# Altium schematic sheet 1_RPi.SchDoc
size A4; DocumentNumber: 1; SheetNumber: 1; SheetTotal: 5
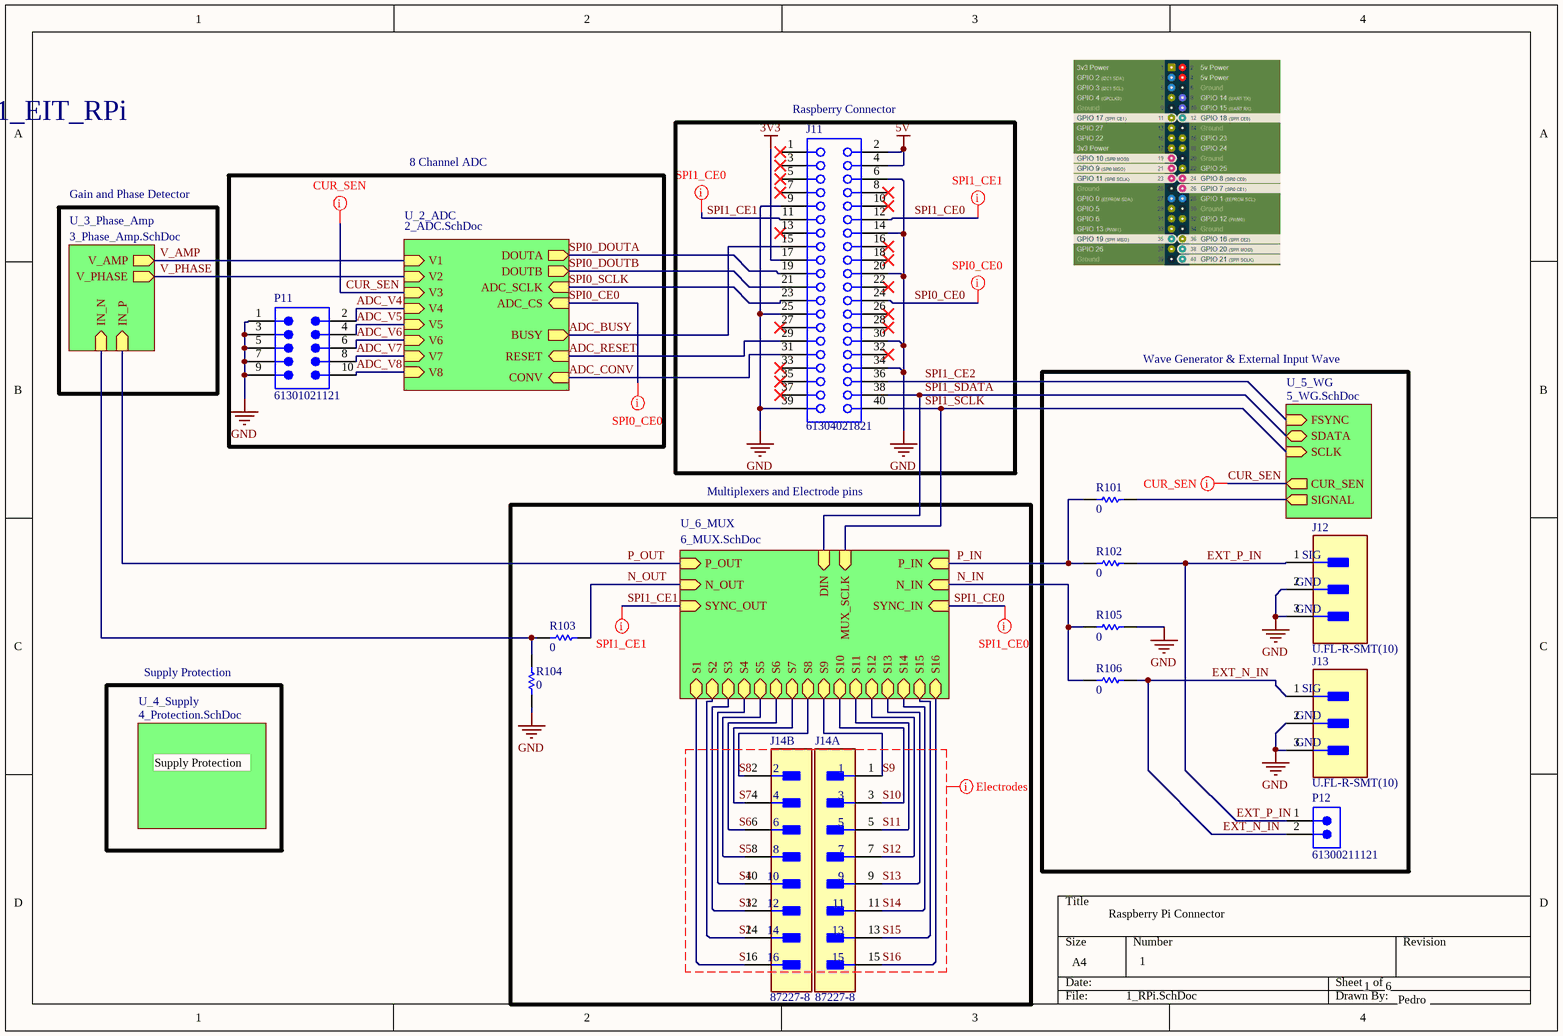
[diagram p0: 1_RPi.SchDoc]

## Parts
J11  61304021821  [61304021821]
J12  U.FL-R-SMT(10)  [FP-U_FL-R-SMT_10-MFG]
J13  U.FL-R-SMT(10)  [FP-U_FL-R-SMT_10-MFG]
J14  87227-8  [FP-87227-8-MFG]  (parts A,B of 2)
P11  61301021121  [61301021121]
P12  61300211121  [61300211121]
R101  Resistance: 0  [RESC1608X55X25LL10T15]  (hidden comment: RC0603JR-070RL)
R102  Resistance: 0  [RESC1608X55X25LL10T15]  (hidden comment: RC0603JR-070RL)
R103  Resistance: 0  [RESC1608X55X25LL10T15]  (hidden comment: RC0603JR-070RL)
R104  Resistance: 0  [RESC1608X55X25LL10T15]  (hidden comment: RC0603JR-070RL)
R105  Resistance: 0  [RESC1608X55X25LL10T15]  (hidden comment: RC0603JR-070RL)
R106  Resistance: 0  [RESC1608X55X25LL10T15]  (hidden comment: RC0603JR-070RL)

## Blocks framed on the sheet
Raspberry Connector: J11
8 Channel ADC: P11
Wave Generator & External Input Wave: J12 J13 P12 R101 R102 R105 R106
Multiplexers and Electrode pins: J14 R103 R104

## Sub-sheets
U_2_ADC = 2_ADC.SchDoc: RESET (in), CONV (in), BUSY (out), ADC_SCLK (in), ADC_CS (in), DOUTA (out), DOUTB (out), V1 (in), V2 (in), V3 (in), V4 (in), V5 (in), V6 (in), V7 (in), V8 (in)
U_3_Phase_Amp = 3_Phase_Amp.SchDoc: V_PHASE (out), V_AMP (out), IN_P (in), IN_N (in)
U_4_Supply = 4_Protection.SchDoc: no entries
U_5_WG = 5_WG.SchDoc: FSYNC (in), SCLK (in), SDATA (bidir), SIGNAL (out), CUR_SEN (out)
U_6_MUX = 6_MUX.SchDoc: P_IN (in), SYNC_IN (in), N_IN (in), S1 (bidir), SYNC_OUT (in), MUX_SCLK (in), DIN (in), S2 (bidir), S3 (bidir), S4 (bidir), S5 (bidir), S6 (bidir), S7 (bidir), S8 (bidir), S9 (bidir), S10 (bidir), S11 (bidir), S12 (bidir), S13 (bidir), S14 (bidir), S15 (bidir), S16 (bidir), P_OUT (in), N_OUT (in)

## Nets
3V3: J11.17
5V: J11.2 J11.4
GND: J11.6 J11.9 J11.14 J11.20 J11.25 J11.30 J11.34 J11.39 J12.2(GND) J12.3(GND) J13.2(GND) J13.3(GND) P11.1 P11.3 P11.5 P11.7 P11.9 R104.2 R105.1
ADC_BUSY: J11.15 ; sheet U_2_ADC/BUSY
ADC_CONV: J11.31 ; sheet U_2_ADC/CONV
ADC_RESET: J11.29 ; sheet U_2_ADC/RESET
ADC_V4: P11.2 ; sheet U_2_ADC/V4
ADC_V5: P11.4 ; sheet U_2_ADC/V5
ADC_V6: P11.6 ; sheet U_2_ADC/V6
ADC_V7: P11.8 ; sheet U_2_ADC/V7
ADC_V8: P11.10 ; sheet U_2_ADC/V8
CUR_SEN: sheet U_2_ADC/V3, sheet U_5_WG/CUR_SEN
EXT_N_IN: J13.1(SIG) P12.2 R106.1
EXT_P_IN: J12.1(SIG) P12.1 R102.1
N_IN: R105.2 R106.2 ; sheet U_6_MUX/N_IN
N_OUT: R103.1 ; sheet U_6_MUX/N_OUT
P_IN: R101.2 R102.2 ; sheet U_6_MUX/P_IN
P_OUT: sheet U_3_Phase_Amp/IN_P, sheet U_6_MUX/P_OUT
S1: J14.16 ; sheet U_6_MUX/S1
S2: J14.14 ; sheet U_6_MUX/S2
S3: J14.12 ; sheet U_6_MUX/S3
S4: J14.10 ; sheet U_6_MUX/S4
S5: J14.8 ; sheet U_6_MUX/S5
S6: J14.6 ; sheet U_6_MUX/S6
S7: J14.4 ; sheet U_6_MUX/S7
S8: J14.2 ; sheet U_6_MUX/S8
S9: J14.1 ; sheet U_6_MUX/S9
S10: J14.3 ; sheet U_6_MUX/S10
S11: J14.5 ; sheet U_6_MUX/S11
S12: J14.7 ; sheet U_6_MUX/S12
S13: J14.9 ; sheet U_6_MUX/S13
S14: J14.11 ; sheet U_6_MUX/S14
S15: J14.13 ; sheet U_6_MUX/S15
S16: J14.15 ; sheet U_6_MUX/S16
SPI0_CE0: J11.24 ; sheet U_2_ADC/ADC_CS
SPI0_DOUTA: J11.19 ; sheet U_2_ADC/DOUTA
SPI0_DOUTB: J11.21 ; sheet U_2_ADC/DOUTB
SPI0_SCLK: J11.23 ; sheet U_2_ADC/ADC_SCLK
SPI1_CE0: J11.12 ; sheet U_6_MUX/SYNC_IN
SPI1_CE1: J11.11 ; sheet U_6_MUX/SYNC_OUT
SPI1_CE2: J11.36 ; sheet U_5_WG/FSYNC
SPI1_SCLK: J11.40 ; sheet U_5_WG/SCLK, sheet U_6_MUX/MUX_SCLK
SPI1_SDATA: J11.38 ; sheet U_5_WG/SDATA, sheet U_6_MUX/DIN
V_AMP: sheet U_2_ADC/V1, sheet U_3_Phase_Amp/V_AMP
V_PHASE: sheet U_2_ADC/V2, sheet U_3_Phase_Amp/V_PHASE
NetR101_1: R101.1 ; sheet U_5_WG/SIGNAL
NetR103_2: R103.2 R104.1 ; sheet U_3_Phase_Amp/IN_N

Not connected (* = marked no-connect by the designer): J11 1* 3* 5* 7* 8* 10* 13* 16* 18* 22* 26* 27* 28* 32* 33* 35* 37*

## Layout directives
mark named SPI0_CE0: SPI0_CE0
mark named SPI1_CE1: SPI1_CE0, SPI1_CE1
mark named SPI1_CE0: SPI1_CE0, SPI1_CE1
mark named CUR_SEN: CUR_SEN
net class Electrodes: S1, S2, S3, S4, S5, S6, S7, S8, S9, S10, S11, S12, S13, S14, S15, S16

## Notes on the sheet
- [1] - 1_EIT_RPi
- Gain and Phase Detector
- Supply Protection
- Raspberry Pi Connector
- 1
- 6
- Pedro

## Library data of the parts
J11 = CMP-1502-01370-3: NexarPartId: 61924769; Gender: Female; Contact Resistance: 20mΩ; Current Rating: 3A; Operating Supply Voltage: 250V; Orientation: Vertical; Lead Pitch: 2.54mm; Number of Pins: 40; RoHS: Non-Compliant
J12 J13 = eef6fde44c591823e8076210edfe12f: CONN U.FL RCPT STR 50 OHM SMD; Plating: Silver; Connector Type: Coaxial; Frequency: 6GHz; Impedance: 50R; Body Material: Bronze; Dielectric Material: Polymer; Contact Plating: Gold; Termination: Solder; Orientation: Vertical; Contact Material: Brass; Min Operating Temperature: -40°C; Mount: Surface Mount; Lead Free: Lead Free; Max Operating Temperature: 90°C; Radiation Hardening: No; Packaging: Tape and Reel; Body Plating: Silver; Fastening Type: Snap; Max Frequency: 6GHz; Depth: 3.1mm; Package Quantity: 1; Case/Package: SMD/SMT; Housing Color: Beige; Length: 3mm
J14 = CMP-03369-000064-1: CONN HEADER VERT 16POS 2.54MM; Manufacturer: TE Connectivity; Conn Gender: Male; Conn Orientation: Straight; Current Rating: 3A; Number Of Contacts: 16; Mouser Description: Headers & Wire Housings UNSHRD VERT DUAL 16; Lead Free: Yes; Digikey Description: CONN HEADER VERT 16POS 2.54MM; Device Class L3: unset; Automotive: No; Height: 0.428inch; Temperature Range Low: -65°C; Device Class L1: Connectors; RoHS: TRUE; Pitch: 2.54mm; Package: 0; Manufacturer Part Number: 87227-8; Number Of Rows: 2; Footprint Url: https://www.te.com/commerce/DocumentDelivery/DDEController?Action=showdoc&DocId=Customer+Drawing%7F87227%7FH4%7Fpdf%7FEnglish%7FENG_CD_87227_H4.pdf%7F87227-8; ComponentLink2URL: https://www.te.com/usa-en/product-87227-8.datasheet.pdf; ComponentLink2Description: Datasheet; Temperature: -65°C to +105°C; Category: Conn; Temperature Range High: +105°C; Octopart: https://octopart.com/87227-8-te+connectivity-39407754; Device Class L2: Headers and Wire Housings; Contact Material: Gold,Nickel
P11 = Header_Male_2R_10P: NexarPartId: 18818163; Connector Type: Male Pin; Insulation Resistance: 1GΩ; Row Spacing: 2.54mm; Insulation: Insulated; Number of Positions: 10; Current Rating: 3A; Voltage Rating: 250V; Gender: Male; Contact Resistance: 20mΩ; Contact Gender: Male; Number of Rows: 2; Min Operating Temperature: -40°C; Mount: Through Hole; Packaging: Bulk; Length: 12.7mm; Pitch: 2.54mm; RoHS: Compliant; Height: 2.54mm; Lead Pitch: 2.54mm; Number of Pins: 10; Housing Material: PBT; Orientation: Vertical; Flammability Rating: UL94 V-0; Termination: Through Hole; Width: 12.7mm; Color: Black; Contact Mating Length: 5.9944mm; Max Operating Temperature: 105°C; Operating Supply Voltage: 250V; Contact Material: Copper; Number of Contacts: 10; Contact Plating: Gold; REACH SVHC: Unknown
P12 = CMP-1712-00002-6: NexarPartId: 20081794; Number of Contacts: 2; Pitch: 2.54mm; Connector Type: Male Pin; Voltage Rating: 250V; Current Rating: 3A; Gender: Male; Contact Resistance: 20mΩ; Height: 8.94mm; Lead Free: Lead Free; Number of Pins: 2; Termination: Through Hole; RoHS: Compliant; Lead Pitch: 2.54mm; REACH SVHC: No SVHC; Housing Material: PBT; Contact Mating Length: 5.9944mm; Min Operating Temperature: -40°C; Orientation: Vertical; Contact Material: Copper; Contact Gender: Male; Max Operating Temperature: 125°C; Number of Rows: 1; Number of Positions: 2; Packaging: Bulk; Contact Plating: Gold; Mount: Through Hole; Color: Black; Operating Supply Voltage: 250V
R101-R106 = RES-2: Chip Resistor, 0 Ohm, +/- 5%, 0.1 W, -55 to 155 degC, 0603 (1608 Metric), RoHS, Tape and Reel; Manufacturer: Yageo; Temperature Coefficient: 200ppm/degreesC; Voltage Rating: 50V; Power Rating: 100mW; Width: 0.8mm; Max Operating Temperature: 155degC; Tolerance: 5%; Package Reference: 0603; Height: 0.45mm; Depth: 0.8mm; Package Description: 2-Pin Surface Mount Device, Body 1.6 x 0.8 mm; Termination: SMD/SMT; Package Quantity: 5000; Case/Package: 0603; Case Code (Imperial): 0603; Radiation Hardening: No; Number of Pins: 2; Length: 1.6mm; Lead Free: LeadFree; Voltage Rating (DC): 50V; Military Standard: Not; Datasheet URL: http://www.yageo.com/NewPortal/yageodocoutput?fileName=/pdf/R-Chip/PYu-RC_Group_51_RoHS_L_5.pdf; Manufacturer URL: http://www.yageo.com/; Packaging: TapeandReel; Case Code (Metric): 1608; Min Operating Temperature: -55degC; Composition: ThickFilm; RoHSCompliant: true; Contact Plating: Tin; Datasheet Version: Rev. 5, 10/2016; REACH SVHC: NoSVHC